# EAGLE design mfos_vco_shapers (EAGLE 7.2.0)
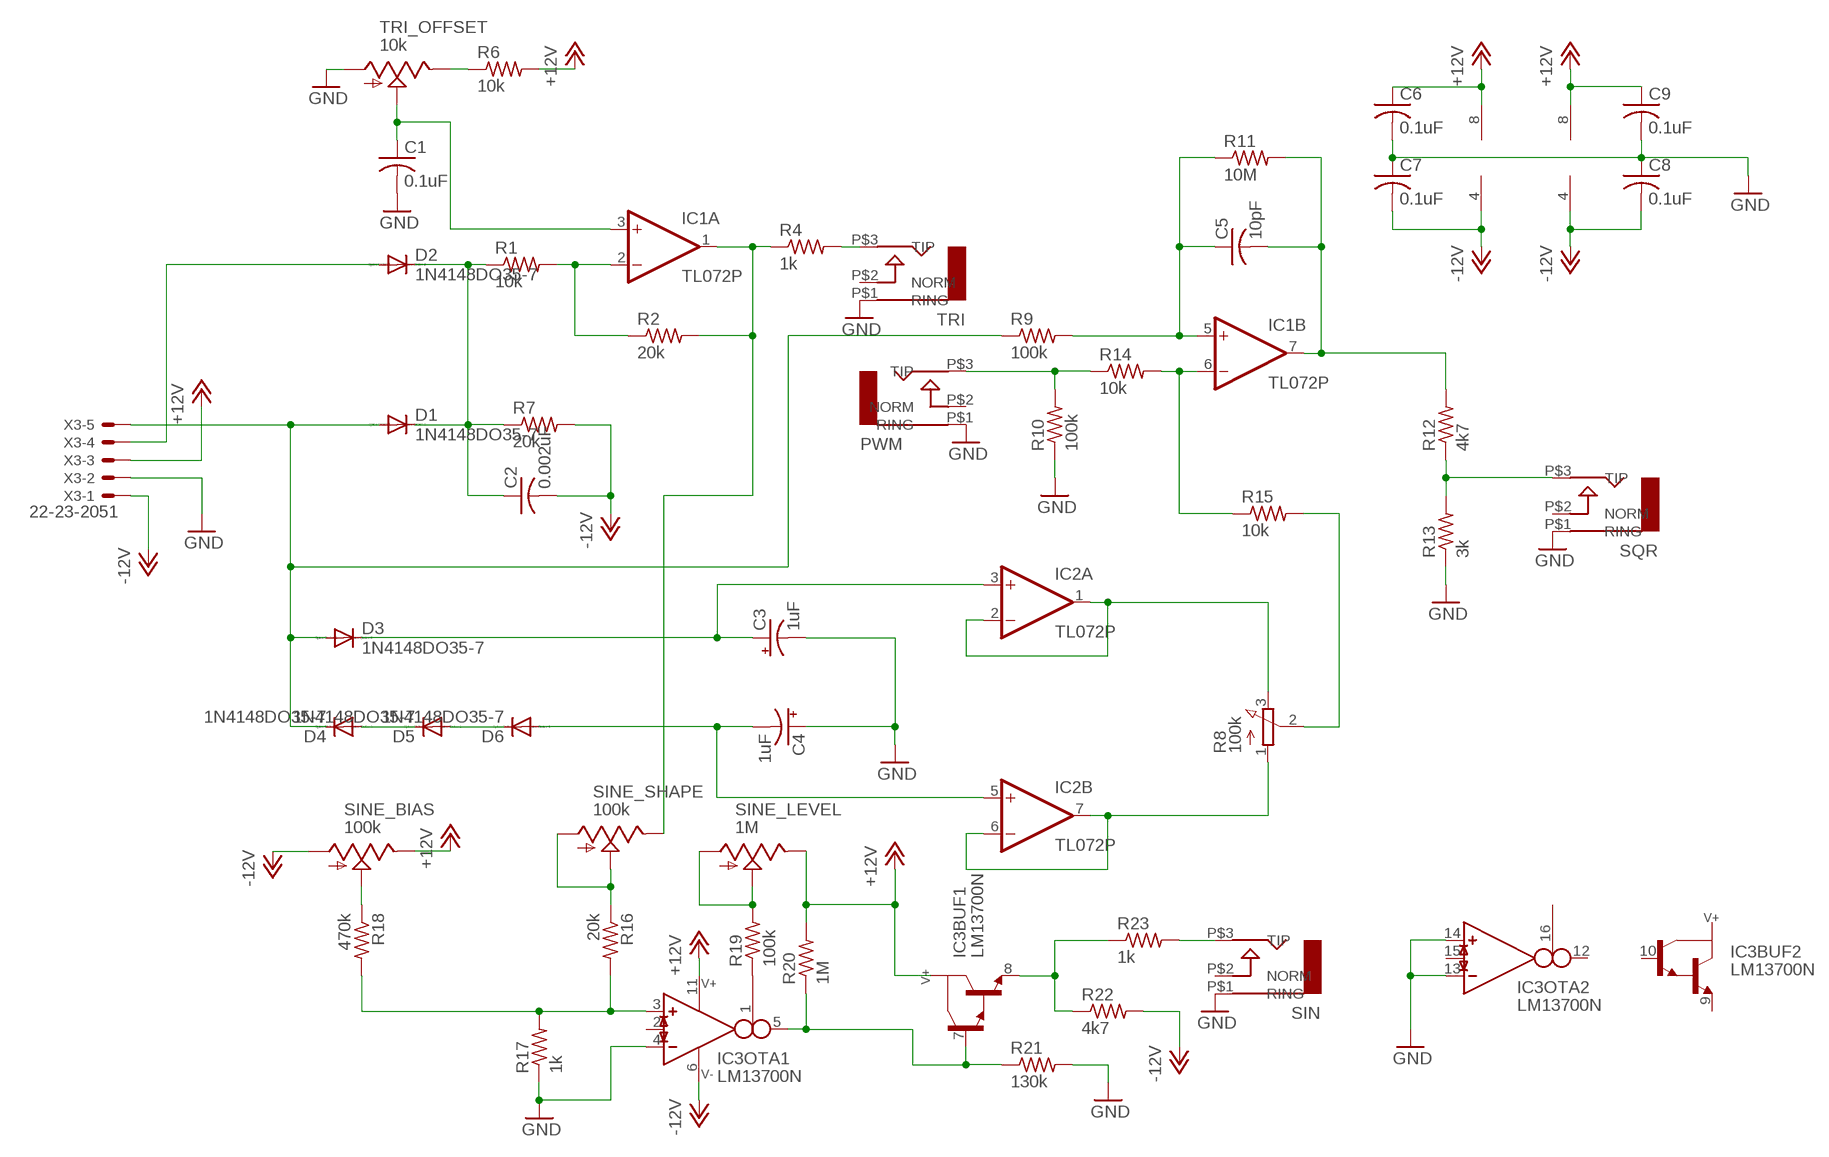
[diagram p0: schematic, sheet 1]

## Parts
C1  0.1uF  C-US050-030X075  [C050-030X075]
C2  0.002uF  C-US050-030X075  [C050-030X075]
C3  1uF  CPOL-USB45181B  [B45181B]
C4  1uF  CPOL-USB45181B  [B45181B]
C5  10pF  C-US050-024X044  [C050-024X044]
C6  0.1uF  C-US050-030X075  [C050-030X075]
C7  0.1uF  C-US050-030X075  [C050-030X075]
C8  0.1uF  C-US050-030X075  [C050-030X075]
C9  0.1uF  C-US050-030X075  [C050-030X075]
D1  1N4148DO35-7  [DO35-7]
D2  1N4148DO35-7  [DO35-7]
D3  1N4148DO35-7  [DO35-7]
D4  1N4148DO35-7  [DO35-7]
D5  1N4148DO35-7  [DO35-7]
D6  1N4148DO35-7  [DO35-7]
IC1  TL072P  [DIL08]
IC2  TL072P  [DIL08]
IC3  LM13700N  [DIL16]
PWM  AUDIO-JACK  [ERTHENVAR-JACK-90DEG]
R1  10k  R-US_0207/7  [0207/7]
R2  20k  R-US_0207/7  [0207/7]
R4  1k  R-US_0207/7  [0207/7]
R6  10k  R-US_0207/7  [0207/7]
R7  20k  R-US_0207/7  [0207/7]
R8  100k  3RP/1610N  [3RP/1610N]
R9  100k  R-US_0207/7  [0207/7]
R10  100k  R-US_0207/7  [0207/7]
R11  10M  R-US_0207/7  [0207/7]
R12  4k7  R-US_0207/7  [0207/7]
R13  3k  R-US_0207/7  [0207/7]
R14  10k  R-US_0207/7  [0207/7]
R15  10k  R-US_0207/7  [0207/7]
R16  20k  R-US_0207/7  [0207/7]
R17  1k  R-US_0207/7  [0207/7]
R18  470k  R-US_0207/7  [0207/7]
R19  100k  R-US_0207/7  [0207/7]
R20  1M  R-US_0207/7  [0207/7]
R21  130k  R-US_0207/7  [0207/7]
R22  4k7  R-US_0207/7  [0207/7]
R23  1k  R-US_0207/7  [0207/7]
SIN  AUDIO-JACK  [ERTHENVAR-JACK-90DEG]
SINE_BIAS  100k  TRIM_US-B64Y  [B64Y]
SINE_LEVEL  1M  TRIM_US-B64Y  [B64Y]
SINE_SHAPE  100k  TRIM_US-B64Y  [B64Y]
SQR  AUDIO-JACK  [ERTHENVAR-JACK-90DEG]
TRI  AUDIO-JACK  [ERTHENVAR-JACK-90DEG]
TRI_OFFSET  10k  TRIM_US-B64Y  [B64Y]
X3  22-23-2051  [22-23-2051]

## Nets
+12V: C6.1 C9.1 IC1.8(P:V+) IC2.8(P:V+) IC3.11(SUPPLY:V+) R6.2 R20.2 SINE_BIAS.E SINE_LEVEL.E X3.3
-12V: C2.2 C7.2 C8.2 IC1.4(P:V-) IC2.4(P:V-) IC3.6(SUPPLY:V-) R7.2 R22.2 SINE_BIAS.A X3.1
GND: C1.2 C3.- C4.+ C6.2 C7.1 C8.1 C9.2 IC3.4(OTA1:IN_N) IC3.13(OTA2:IN_N) IC3.14(OTA2:IN_P) PWM.P$1(RING) R10.1 R13.1 R17.1 R21.2 SIN.P$1(RING) SQR.P$1(RING) TRI.P$1(RING) TRI_OFFSET.A X3.2
N$1: D4.A D5.C
N$2: D5.A D6.C
N$3: C2.1 D1.C D2.C R1.1 R7.1
N$4: IC1.2(A:-IN) R1.2 R2.1
N$5: IC1.1(A:OUT) R2.2 R4.1 SINE_SHAPE.E
N$6: R4.2 TRI.P$3(TIP)
N$7: R6.1 TRI_OFFSET.E
N$8: C1.1 IC1.3(A:+IN) TRI_OFFSET.S
N$9: C4.- D6.A IC2.5(B:+IN)
N$10: C3.+ D3.C IC2.3(A:+IN)
N$11: IC2.1(A:OUT) IC2.2(A:-IN) R8.3(E)
N$13: IC2.6(B:-IN) IC2.7(B:OUT) R8.1(A)
N$14: PWM.P$3(TIP) R10.2 R14.1
N$15: C5.1 IC1.5(B:+IN) R9.2 R11.1
N$17: IC1.6(B:-IN) R14.2 R15.1
N$18: C5.2 IC1.7(B:OUT) R11.2 R12.2
N$19: R8.2(S) R15.2
N$20: R12.1 R13.2 SQR.P$3(TIP)
N$21: IC3.3(OTA1:IN_P) R16.2 R17.2 R18.2
N$22: R16.1 SINE_SHAPE.A SINE_SHAPE.S
N$23: R18.1 SINE_BIAS.S
N$24: R23.2 SIN.P$3(TIP)
N$25: IC3.1(OTA1:I_BIAS) R19.1
N$26: R19.2 SINE_LEVEL.A SINE_LEVEL.S
N$27: IC3.8(BUF1:E) R22.1 R23.1
N$28: IC3.5(OTA1:OUT) IC3.7(BUF1:B) R20.1 R21.1
N$33: D2.A X3.4
N$35: D1.A D3.A D4.C R9.1 X3.5
Unconnected: IC3.2(OTA1:I_DIODE) IC3.9(BUF2:E) IC3.10(BUF2:B) IC3.12(OTA2:OUT) IC3.15(OTA2:I_DIODE) IC3.16(OTA2:I_BIAS) PWM.P$2(NORM) SIN.P$2(NORM) SQR.P$2(NORM) TRI.P$2(NORM)

## Library data of the parts
C1 C2 C5-C9 = rcl:C-US: CAPACITOR, American symbol
C3 C4 = rcl:CPOL-US: POLARIZED CAPACITOR, American symbol
D1-D6 = diode:1N4148: DIODE high speed (Philips)
IC1 IC2 = linear:TL072: OP AMP
IC3 = ota:LM13700: Dual OTA with buffers
PWM SIN SQR TRI = erthenvar:AUDIO-JACK: Switching Mono 3.5mm Audio Jack from Erthenvar.
R1 R2 R4 R6 R7 R9-R23 = rcl:R-US_: RESISTOR, American symbol
R8 = pot:3RP/1610N: 16mm Potentiometer one level Source: http://www.alphapotentiometers.net/html/16mm_pot_2.html
SINE_BIAS SINE_LEVEL SINE_SHAPE TRI_OFFSET = pot:TRIM_US-: POTENTIOMETER
X3 = con-molex:22-23-2051: .100" (2.54mm) Center Header - 5 Pin; MF: MOLEX; MPN: 22-23-2051; OC_FARNELL: 1462952; OC_NEWARK: 38C9178

## Board
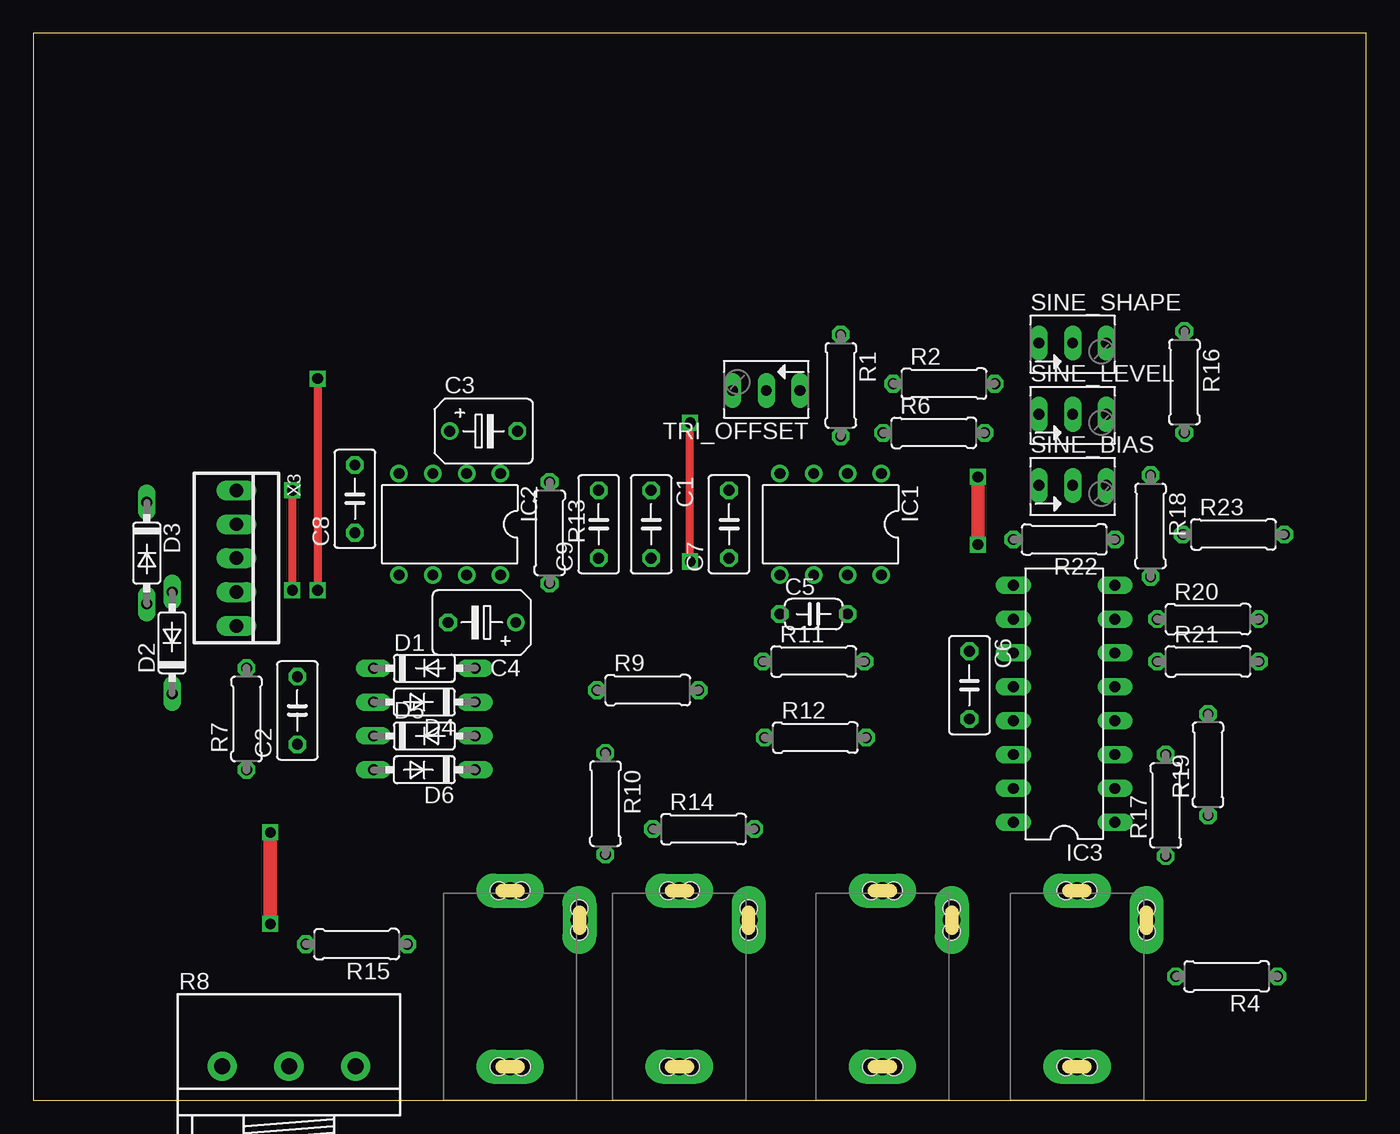
[diagram p1: board, top side]
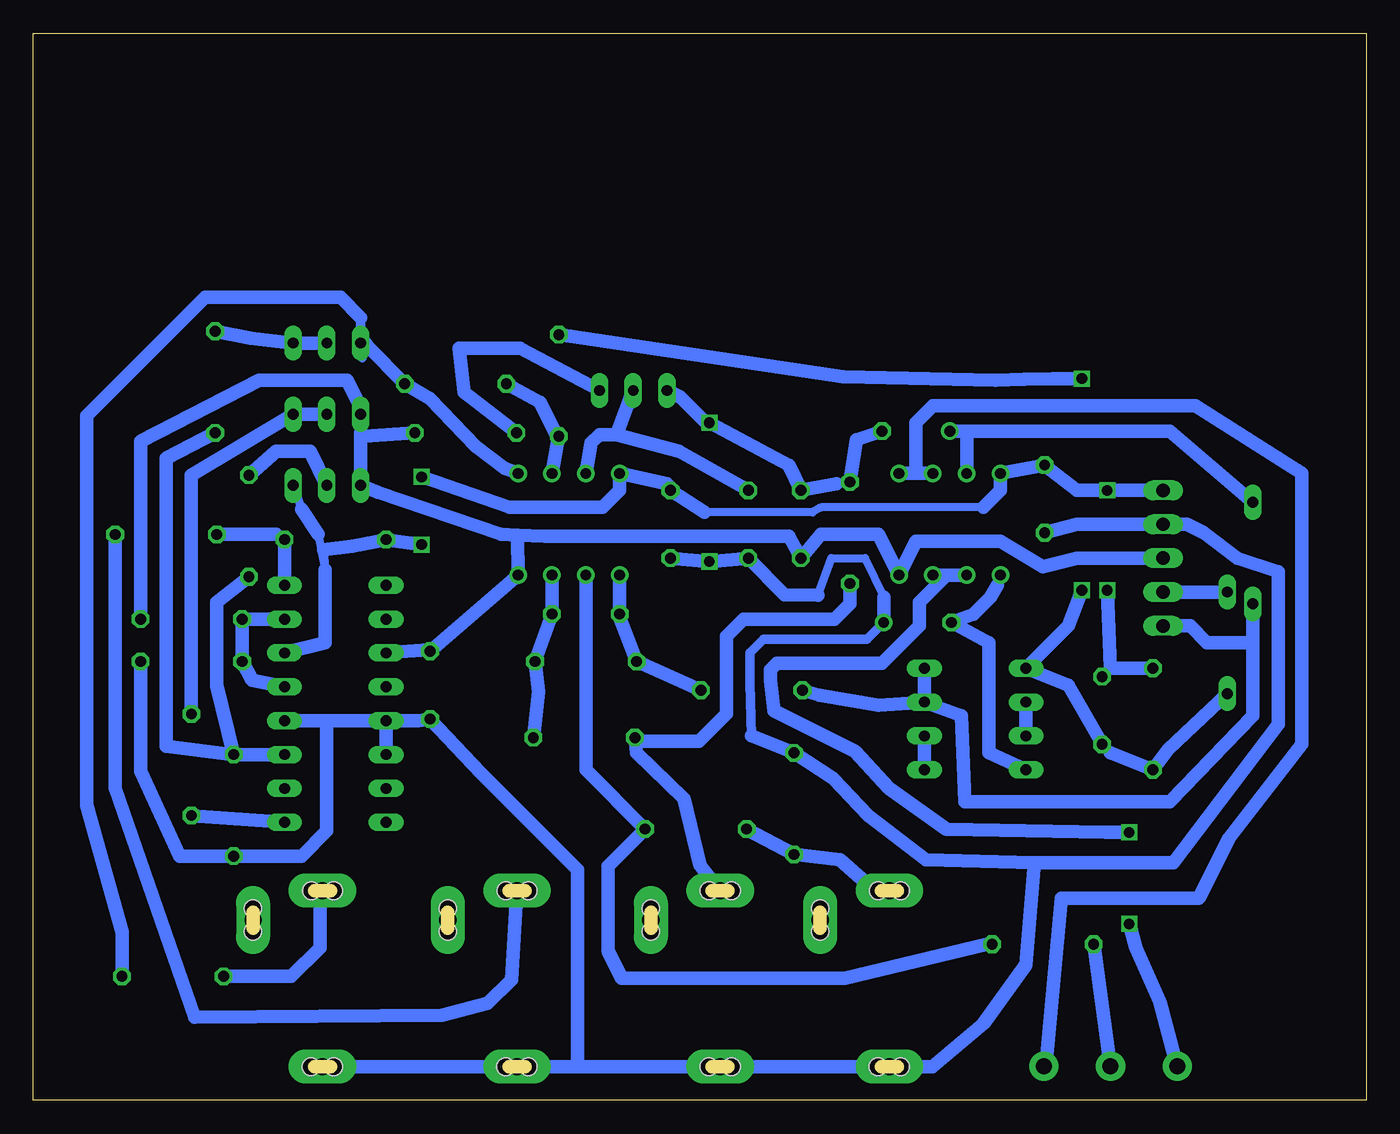
[diagram p2: board, bottom side, seen from below]

Size 100 x 80 mm. Coordinates in mm from the lower left corner, seen from the top.
Outline: 0,0 100,0 100,80 0,80 0,0
Copper layers (1*16): Top 0.035mm / dielectric 1.5mm / Bottom 0.035mm
Design rules "default *": minimum track width 24mil, minimum drill 24mil, track to track 14mil, track to pad 14mil, pad to pad 14mil, via to via 14mil, smd to smd 8mil, copper to edge 0mil, drill to drill 8mil, minimum pad ring 10mil, minimum via ring 8mil, stop-mask expansion 4mil, vias tented up to drill 0mil, thermal gap 10mil

### Footprints (pad centres in the part's own frame; a part is rotated, then mirrored left to right if it is on the bottom)
C050-030X075 = drill 0.813 octagon: 1 -2.54,0; 2 2.54,0
B45181B = drill 0.813: + -2.54,0 | drill 0.813 octagon: - 2.54,0
C050-024X044 = drill 0.813 octagon: 1 -2.54,0; 2 2.54,0
DO35-7 = drill 0.813 long: A 3.81,0; C -3.81,0
DIL08 = drill 0.813 pad 1.27: 1 -3.81,-3.81; 2 -1.27,-3.81; 3 1.27,-3.81; 4 3.81,-3.81; 5 3.81,3.81; 6 1.27,3.81; 7 -1.27,3.81; 8 -3.81,3.81
DIL16 = drill 0.813 long: 1 -8.89,-3.81; 2 -6.35,-3.81; 3 -3.81,-3.81; 4 -1.27,-3.81; 5 1.27,-3.81; 6 3.81,-3.81; 7 6.35,-3.81; 8 8.89,-3.81; 9 8.89,3.81; 10 6.35,3.81; 11 3.81,3.81; 12 1.27,3.81; 13 -1.27,3.81; 14 -3.81,3.81; 15 -6.35,3.81; 16 -8.89,3.81
ERTHENVAR-JACK-90DEG = drill 1.3 pad 2.54 long: P$1 5,-2.5; P$2 -0.2,-13.5; P$3 5,-15.7 | hole 1.3: 5.842,-2.489; 4.14,-2.489; -0.203,-12.649; -0.203,-14.351; 5.842,-15.697; 4.166,-15.697
0207/7 = drill 0.813 octagon: 1 -3.81,0; 2 3.81,0
3RP/1610N = drill 1.2 pad 2.184: 1 -5,0; 2 0,0; 3 5,0
B64Y = drill 0.813 long: A 2.54,0; E -2.54,0; S 0,0
22-23-2051 = drill 1 long: 1 -5.08,0; 2 -2.54,0; 3 0,0; 4 2.54,0; 5 5.08,0

### Placement (x,y rotation side)
C1  46.35,43.18 270 top
C2  19.81,29.21 90 top
C3  33.78,50.16 0 top
C4  33.66,35.81 180 top
C5  58.55,36.45 0 top
C6  70.23,31.11 270 top
C7  52.2,43.18 90 top
C8  24.13,45.09 90 top
C9  42.42,43.18 90 top
D1  29.34,32.38 0 top
D2  10.41,34.29 90 top
D3  8.51,41.02 270 top
D4  29.34,29.84 180 top
D5  29.34,27.3 0 top
D6  29.34,24.77 180 top
IC1  59.82,43.18 180 top
IC2  31.24,43.18 180 top
IC3  77.34,29.72 90 top
PWM  40.77,0 180 top
R1  60.58,53.59 270 top
R2  68.33,53.72 0 top
R4  89.53,9.27 180 top
R6  67.56,50.04 0 top
R7  16,28.57 90 top
R8  19.18,2.54 0 top
R9  46.1,30.73 0 top
R10  42.93,22.23 270 top
R11  58.55,32.89 0 top
R12  58.67,27.18 0 top
R13  38.73,42.55 270 top
R14  50.29,20.32 0 top
R15  24.26,11.68 180 top
R16  86.36,53.85 270 top
R17  84.96,22.1 90 top
R18  83.82,43.05 270 top
R19  88.14,25.15 90 top
R20  88.14,36.07 0 top
R21  88.14,32.89 0 top
R22  77.34,42.04 180 top
R23  90.04,42.42 0 top
SIN  68.71,0 180 top
SINE_BIAS  77.98,46.1 0 top
SINE_LEVEL  77.98,51.44 0 top
SINE_SHAPE  77.98,56.77 0 top
SQR  53.47,0 180 top
TRI  83.31,0 180 top
TRI_OFFSET  54.99,53.21 180 top
X3  15.24,40.64 270 top

### Tracks (layer width: path | path; a pad name or v marks a point on that pad's centre or on a via)
+12V
  Bottom 0.61: C6.1 70.36,33.78 | 75.44,51.94 SINE_LEVEL.E 75.44,50.04 75.18,49.78
  Bottom 1.016: 63.68,42.36 61.59,42.29 43.31,42.29 C9.1 40.89,42.42 36.58,42.42 IC2.8 33.78,41.91 27.43,41.91 24.26,40.01 21.72,40.64 X3.3 | 63.68,42.36 IC1.8 C6.1 | 70.36,33.78 IC3.11 | 75.44,50.04 SINE_BIAS.E 74.17,45.59 64.9,42.42 63.68,42.36 | 75.44,51.94 76.45,53.98 83.06,53.98 91.95,49.4 R20.2 | R6.2 75.18,49.78
-12V  (via drill 0.8)
  Top 0.61: v19.43,45.72 v19.43,38.23
  Top 1.016: v70.87,46.74 v70.87,41.66
  Bottom 0.61: 52.45,46.23 C7.2 | 78.61,42.42 78.11,39.75 78.23,41.27 | SINE_BIAS.A 79.88,44.32 | 28.7,44.45 40.89,44.45 41.53,44.07 49.66,44.07 | 19.18,32.38 C2.2
  Bottom 1.016: 52.45,46.23 IC1.4 56.01,45.72 57.28,44.45 64.26,44.45 v70.87,46.74 | IC3.6 78.11,34.29 78.11,39.75 | 79.88,44.32 78.61,42.42 | v70.87,41.66 R22.2 76.07,41.53 78.23,41.27 | 28.7,44.45 27.43,45.72 IC2.4 C8.2 21.72,45.72 v19.43,45.72 X3.1 | 49.66,44.07 C7.2 | v19.43,38.23 19.18,32.38 R7.2
GND  (via drill 0.8)
  Top 0.61: v49.28,40.39 v49.28,50.8
  Bottom 0.61: R13.1 39.75,46.23 | 41.15,37.85 40.13,40.64 37.59,40.64 36.2,37.72 | 32.55,2.5 32.51,2.54
  Bottom 0.711: 46.1,27.3 46.23,31.24 46.23,33.53 45.21,34.54 37.47,34.54 C4.+ | 49.53,50.8 v49.28,50.8
  Bottom 1.016: C8.1 21.72,43.18 X3.2 13.46,43.18 12.19,42.55 9.65,40.64 6.6,39.62 6.6,28.19 14.48,17.78 24.89,17.78 | IC3.13 71.12,28.45 C6.2 66.42,24.51 59.18,17.27 59.18,2.5 | IC3.14 IC3.13 | 39.75,46.23 C9.2 43.31,47.62 v49.28,50.8 | C3.- 38.23,49.53 R13.1 | 49.53,50.8 51.44,52.7 TRI_OFFSET.A | R21.2 91.95,24.64 89.03,18.29 R17.1 79.88,18.29 77.98,20.19 77.98,28.45 | 36.2,37.72 C4.+ | 41.15,37.85 43.65,37.89 C1.2 v49.28,40.39 C7.1 | 24.89,17.78 33.02,18.03 37.34,21.34 40.01,24.13 R10.1 46.1,27.3 | 32.55,2.5 PWM.P$1 SQR.P$1 59.18,2.5 | 32.51,2.54 28.7,5.71 25.53,10.16 24.89,17.78 | IC3.13 77.98,28.45 | IC3.4 77.98,28.45 | 59.18,2.5 SIN.P$1 TRI.P$1
N$1
  Bottom 1.016: D4.A D5.C
N$2
  Bottom 1.016: D5.A D6.C
N$3  (via drill 0.8)
  Top 0.61: v21.34,54.1 v21.34,38.23
  Bottom 0.61: C2.1 19.18,26.04
  Bottom 1.016: 19.18,26.04 R7.1 14.86,26.29 D2.C | C2.1 22.35,31.11 D1.C 22.35,35.56 v21.34,38.23 | R1.1 59.69,57.28 39.24,54.23 27.81,53.98 arc2 v21.34,54.1
N$4
  Bottom 0.61: R1.2 60.71,49.78
  Bottom 1.016: R1.2 IC1.2 | 60.71,49.78 61.98,52.32 R2.1
N$5
  Bottom 0.61: 75.06,56.77 75.31,55.63 SINE_SHAPE.E
  Bottom 0.711: 75.44,58.67 SINE_SHAPE.E
  Bottom 1.016: 75.06,56.77 74.93,56.52 R2.2 70.23,52.58 66.8,49.02 64.64,47.37 IC1.1 | R4.1 93.34,12.57 96.01,22.1 96.01,51.31 87.12,60.2 76.96,60.2 75.44,58.67
N$6
  Bottom 0.711: 78.49,15.53 TRI.P$3
  Bottom 1.016: R4.2 80.64,9.27 78.49,11.43 78.49,15.53
N$7
  Bottom 1.016: TRI_OFFSET.E 63.5,56.39 68.07,56.39 67.69,53.09 R6.1
N$8
  Bottom 1.016: TRI_OFFSET.S 56.26,49.91 | 56.26,49.91 57.53,49.91 58.17,49.28 IC1.3 | C1.1 51.56,48.64 56.26,49.91
N$9
  Bottom 0.61: 27.69,38.61 IC2.5
  Bottom 1.016: D6.A 28.32,26.04 28.32,34.29 C4.- 29.46,36.45 28.19,37.72 27.69,38.61
N$10
  Bottom 1.016: D3.C 14.73,50.16 29.97,50.16 | C3.+ 29.97,50.16 | 29.97,50.16 IC2.3
N$11
  Bottom 1.016: IC2.1 33.78,46.99 | 33.78,46.99 IC2.2 | R8.3 24.05,2.59 22.86,15.11 12.57,15.11 10.29,19.68 4.83,26.67 4.83,46.99 12.83,52.07 32.51,52.07 33.78,50.8 33.78,46.99
N$13  (via drill 0.8)
  Top 1.016: v17.78,20.07 v17.78,13.21
  Bottom 1.016: IC2.7 IC2.6 31.5,39.37 33.53,37.34 33.53,35.56 36.32,32.77 44.2,32.77 44.7,32.26 44.7,31.5 44.45,29.21 38.35,26.16 35.81,23.37 31.5,20.32 19.56,20.07 v17.78,20.07 | v17.78,13.21 17.27,11.43 15.49,7.37 14.22,2.59 R8.1
N$14
  Bottom 0.61: PWM.P$3 36.02,15.83
  Bottom 1.016: R14.1 R10.2 39.5,18.03 37.21,16 36.02,15.83
N$15
  Bottom 0.61: C5.1 56.01,36.2
  Bottom 1.016: R9.2 R11.1 56.01,36.2 | IC1.5 C5.1
N$17
  Bottom 1.016: IC1.6 58.55,24.77 R14.2 56.9,17.53 56.9,11.18 55.88,9.14 39.12,9.14 28.45,11.68 R15.1
N$18
  Bottom 1.016: IC1.7 C5.2 R11.2 62.1,30.61 R12.2
N$19
  Bottom 1.016: R8.2 R15.2
N$20
  Bottom 0.711: 54.61,26.92 R12.1
  Bottom 1.016: SQR.P$3 49.99,17.61 51.18,22.61 54.74,26.04 R12.1 | R13.2 38.73,37.21 39.88,36.07 46.74,36.07 48.01,34.8 48.01,28.96 50.04,26.92 54.61,26.92
N$21
  Bottom 1.016: R17.2 IC3.3 | R18.2 86.23,37.34 86.23,31.11 R17.2 | R16.2 90.04,48.13 90.04,26.54 R17.2
N$22
  Bottom 1.016: SINE_SHAPE.S SINE_SHAPE.A 83.69,57.15 R16.1
N$23
  Bottom 1.016: SINE_BIAS.S 79.25,48.64 81.79,48.64 R18.1
N$24
  Bottom 0.61: SIN.P$3 63.71,15.96
  Bottom 1.016: R23.2 93.85,23.37 87.88,6.22 69.34,6.35 65.91,7.24 64.14,9.02 63.71,15.96
N$25
  Bottom 1.016: R19.1 IC3.1
N$26
  Bottom 1.016: R19.2 88.14,46.86 SINE_LEVEL.A SINE_LEVEL.S
N$27
  Bottom 0.61: 81.79,42.42 R22.1
  Bottom 1.016: R22.1 IC3.8 | R23.1 81.79,42.42
N$28
  Bottom 1.016: IC3.7 R20.1 R21.1 83.57,31.5 IC3.5
N$33
  Bottom 1.016: X3.4 D2.A
N$35
  Bottom 1.016: D1.A D4.C | R9.1 41.02,30.35 36.58,29.59 D4.C | 8.51,34.54 8.51,28.83 14.73,22.35 30.1,22.35 30.35,28.83 D4.C | 8.51,34.54 D3.A | X3.5 13.21,35.56 11.94,34.29 8.76,34.29 8.51,34.54